# EAGLE design batt_test (EAGLE 9.5.2)
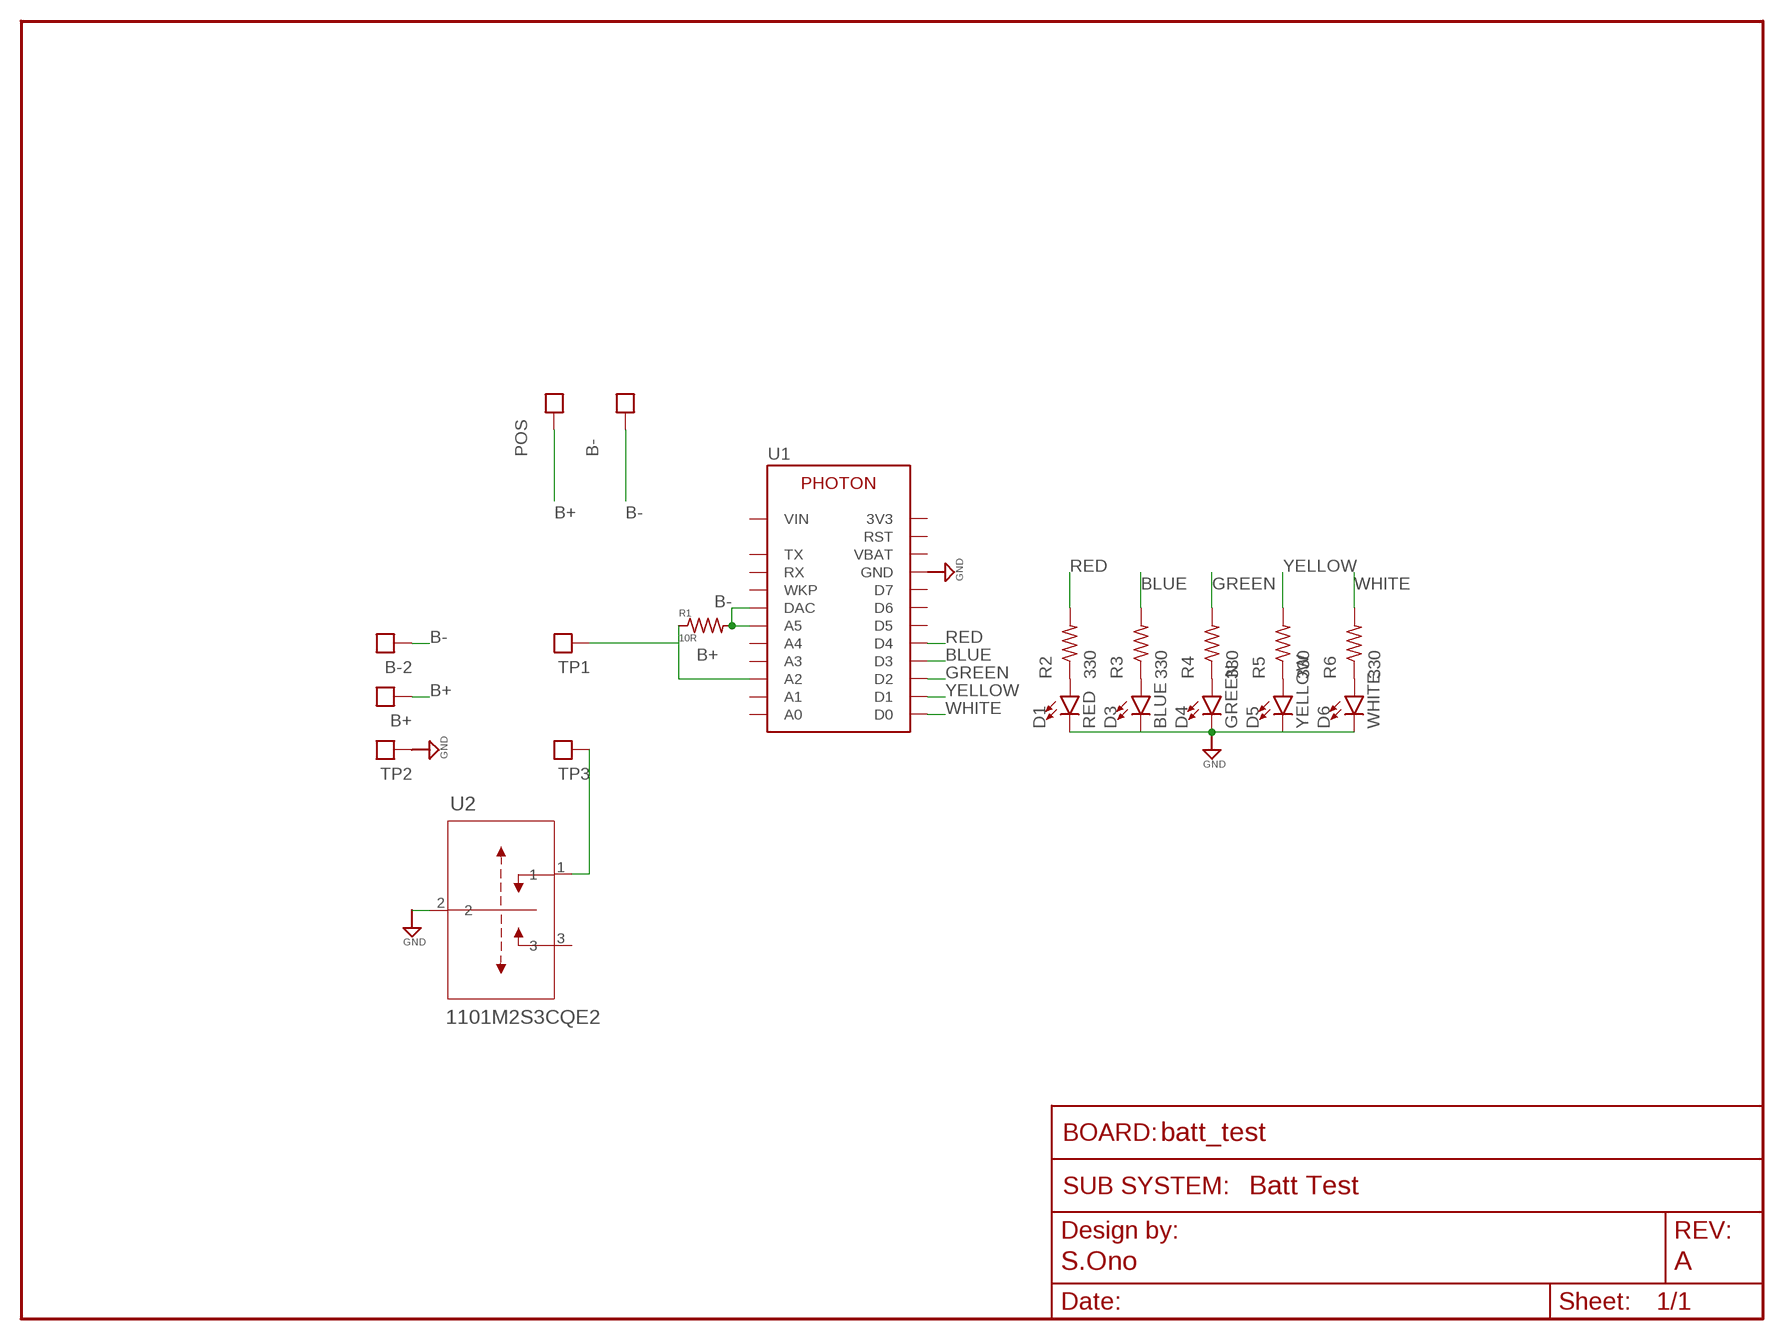
[diagram p0: schematic, sheet 1]
FRAME1 (FRAME_SCHEMATIC): AUTHOR: S.Ono; REV: A; SUBSYSTEM_NAME: Batt Test

## Parts
B+  TEST_POINTTHRU  [TEST_POINT]
B-  TEST_POINT  [TEST_POINT-1206]
B-2  TEST_POINTTHRU  [TEST_POINT]
D1  RED  LED0603  [LED-0603]
D3  BLUE  LED0603  [LED-0603]
D4  GREEN  LED0603  [LED-0603]
D5  YELLOW  LED0603  [LED-0603]
D6  WHITE  LED0603  [LED-0603]
POS  TEST_POINT  [TEST_POINT-1206]
R1  10R  R-US_R0805  [R0805]
R2  330  R-US_R0402  [R0402]
R3  330  R-US_R0402  [R0402]
R4  330  R-US_R0402  [R0402]
R5  330  R-US_R0402  [R0402]
R6  330  R-US_R0402  [R0402]
TP1  TEST_POINTTHRU  [TEST_POINT]
TP2  TEST_POINTTHRU  [TEST_POINT]
TP3  TEST_POINTTHRU  [TEST_POINT]
U1  PHOTON  [PHOTON]
U2  1101M2S3CQE2  [1101M2S3CQE2]

## Nets
B+: B+.1 POS.1 R1.1 TP1.1 U1.A2
B-: B-2.1 B-.1 R1.2 U1.A5 U1.DAC
BLUE: R3.2 U1.D3
GND: D1.C D3.C D4.C D5.C D6.C TP2.1 U1.GND U1.GND@1(GND) U2.2
GREEN: R4.2 U1.D2
N$1: TP3.1 U2.1
N$6: D1.A R2.1
N$8: D3.A R3.1
N$9: D4.A R4.1
N$11: D5.A R5.1
N$12: D6.A R6.1
RED: R2.2 U1.D4
WHITE: R6.2 U1.D0
YELLOW: R5.2 U1.D1
Unconnected: U1.3V3 U1.A0 U1.A1 U1.A3 U1.A4 U1.D5 U1.D6 U1.D7 U1.RST U1.RX U1.TX U1.VBAT U1.VIN U1.WKP U2.3

## Library data of the parts
B+ B- B-2 POS TP1-TP3 = scono:TEST_POINT: 1206 Test point for O-scope probes. For A106146CT-ND or similar
D1 D3-D6 = scono:LED: https://www.digikey.com/products/en/optoelectronics/led-indication-discrete/105?k=&pkeyword=&pv7=2&pv1989=0&pv16=5&FV=ffe00069&quantity=0&ColumnSort=0&page=1&pageSize=25
R1 = scono:R-US_: RESISTOR, American symbol; PIE-INT-REF-NUM: RESISTOR-GENERIC
R2-R6 = BEST_Custom:R-US_: RESISTOR, American symbol; PIE-INT-REF-NUM: RESISTOR-GENERIC
U1 = scono:PHOTON
U2 = scono:1101M2S3CQE2: https://www.digikey.com/product-detail/en/c-k/1101M2S3CQE2/CKN5001-ND/67042; MANUFACTURER_PART_NUMBER: 1101M2S3CQE2; VENDOR: C&K

## Board
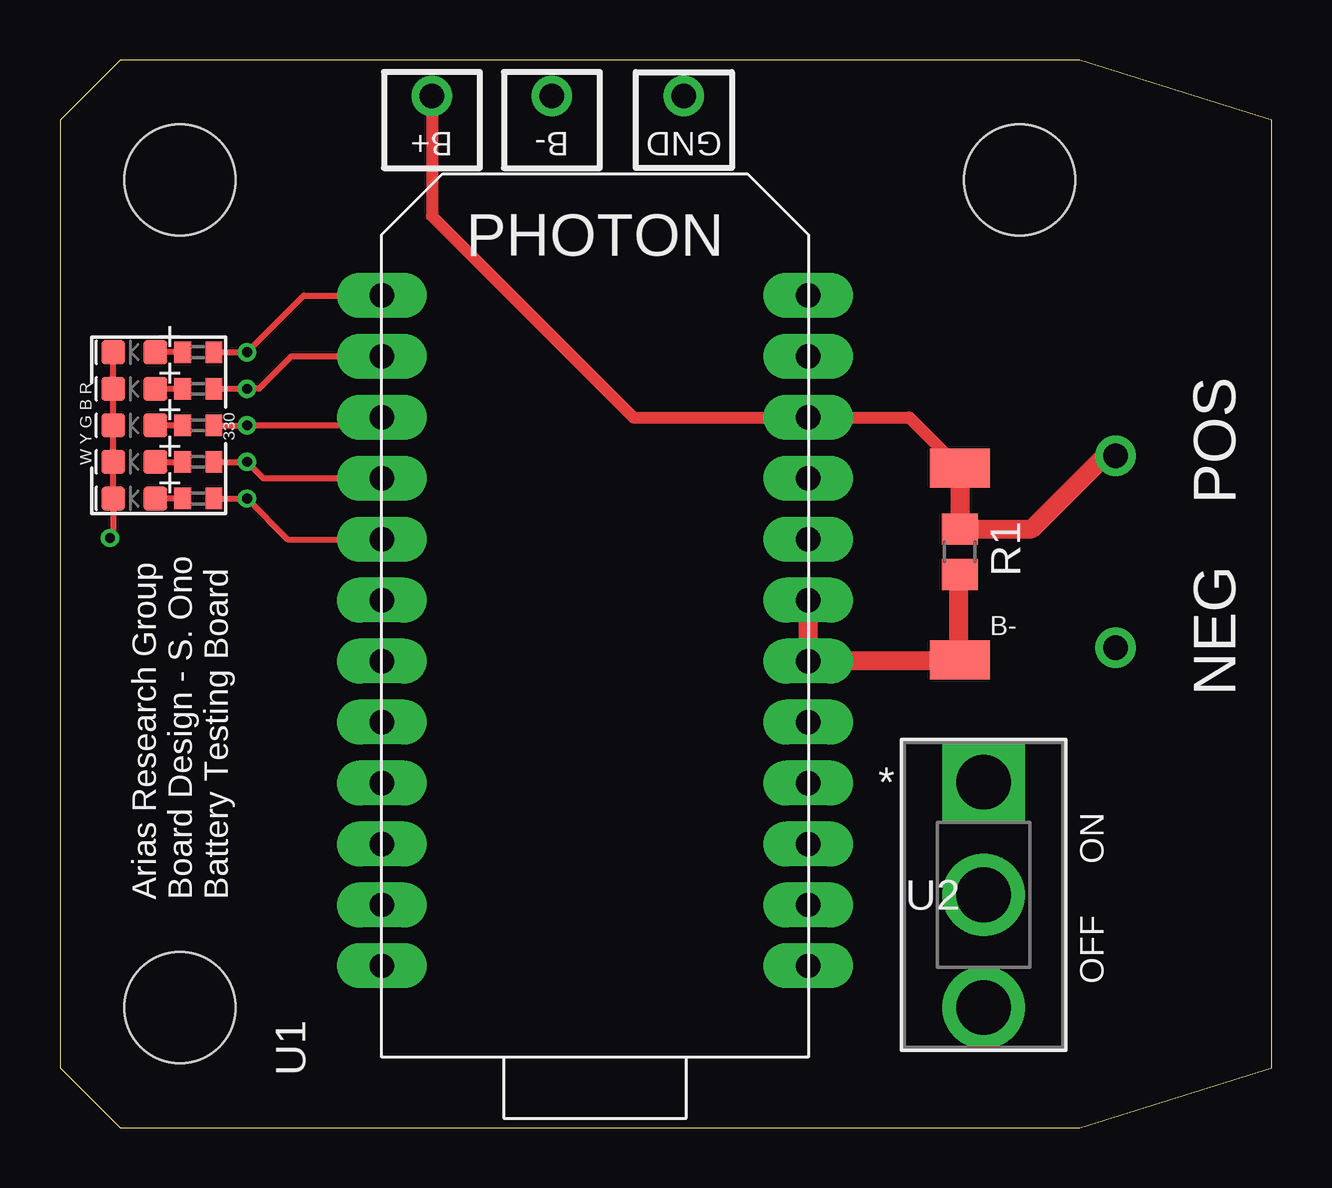
[diagram p1: board, top side]
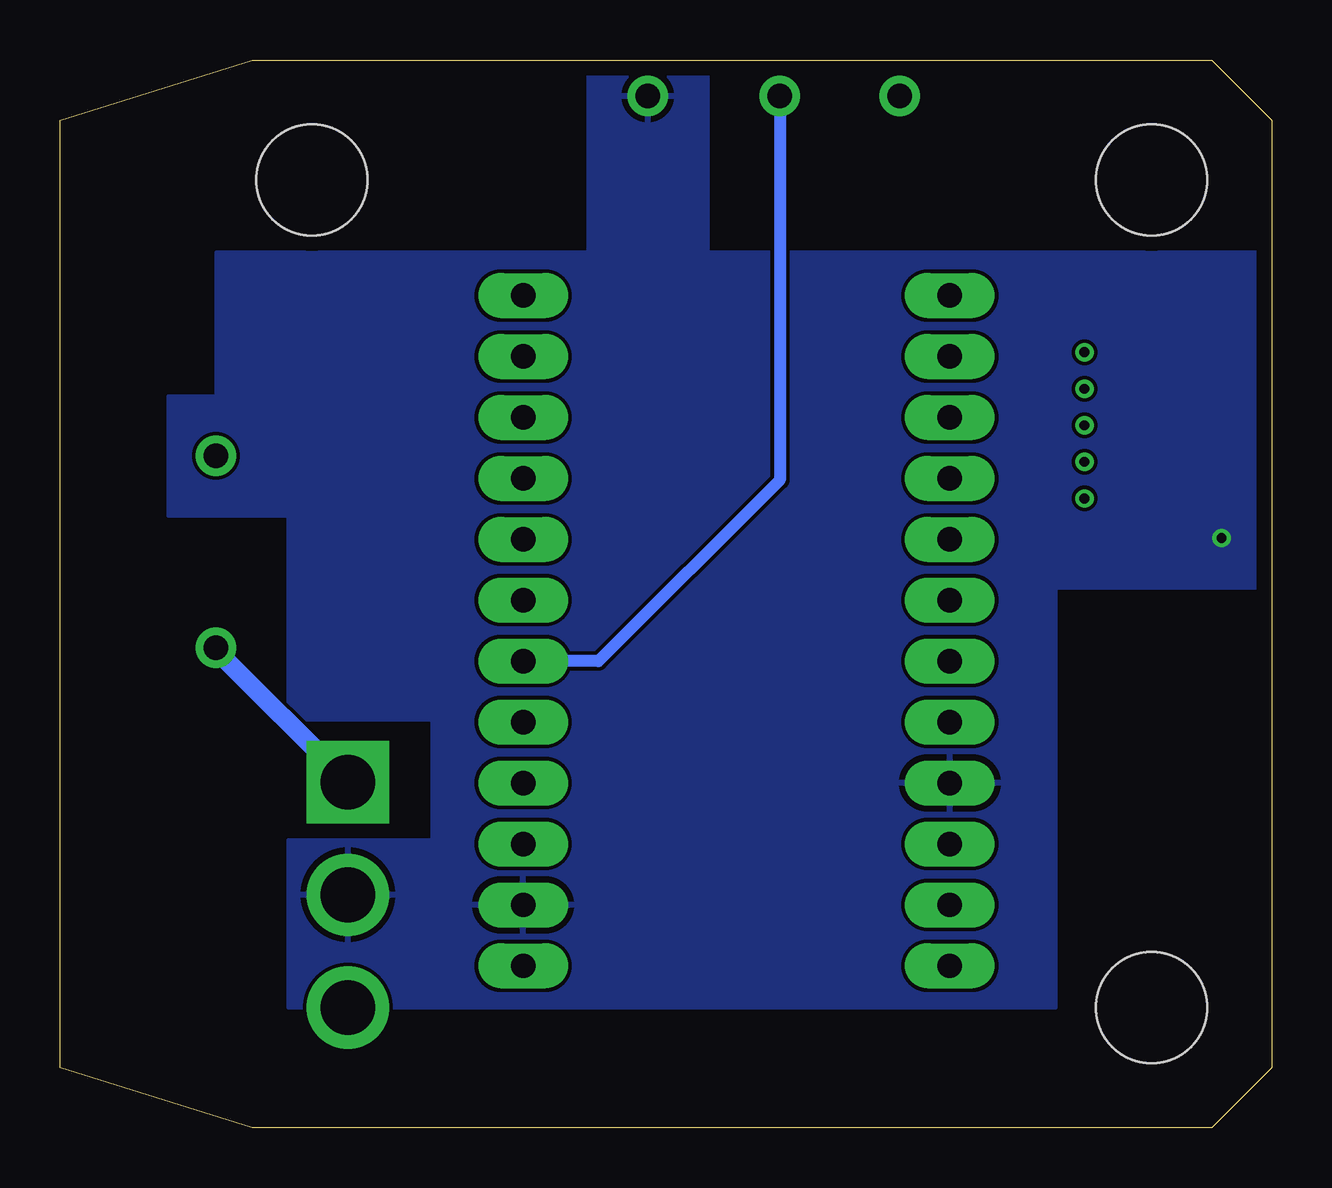
[diagram p2: board, bottom side, seen from below]

Size 50.5 x 44.5 mm. Coordinates in mm from the lower left corner, seen from the top.
Outline: 0,2.5 2.5,0 42.5,0 50.5,2.5 50.5,42 42.5,44.5 2.5,44.5 0,42 0,2.5
Copper layers (1*16): Top 2mil / dielectric 9mil / Bottom 2mil
Design rules "scono *": minimum track width 6mil, minimum drill 15mil, track to track 6mil, track to pad 6mil, pad to pad 6mil, via to via 6mil, smd to smd 6mil, copper to edge 25mil, drill to drill 7mil, minimum pad ring 7mil, minimum via ring 7mil, stop-mask expansion 3mil, vias tented up to drill 0mil, thermal gap 10mil

### Footprints (pad centres in the part's own frame; a part is rotated, then mirrored left to right if it is on the bottom)
TEST_POINT = drill 1.016 pad 1.676: 1 0,0
TEST_POINT-1206 = smd 2.5 x 1.625: 1 0,0
LED-0603 = smd 1 x 1: A -0.877,0; C 0.877,0
R0805 = smd 1.3 x 1.5: 1 -0.95,0; 2 0.95,0
R0402 = smd 0.7 x 0.9: 1 -0.65,0; 2 0.65,0
PHOTON = drill 1.016 pad 1.88 long: 3V3 -15.24,8.89; A0 12.7,-8.89; A1 10.16,-8.89; A2 7.62,-8.89; A3 5.08,-8.89; A4 2.54,-8.89; A5 0,-8.89; D0 12.7,8.89; D1 10.16,8.89; D2 7.62,8.89; D3 5.08,8.89; D4 2.54,8.89; D5 0,8.89; D6 -2.54,8.89; D7 -5.08,8.89; DAC -2.54,-8.89; GND -7.62,8.89; GND@1 -12.7,-8.89; RST -12.7,8.89; RX -7.62,-8.89; TX -10.16,-8.89; VBAT -10.16,8.89; VIN -15.24,-8.89; WKP -5.08,-8.89
1101M2S3CQE2 = drill 2.286 pad 2.794 square: 1 0,9.398 | drill 2.286 pad 2.794: 2 0,4.699; 3 0,0
4-40-HOLE = hole 4.636: 0,0

### Placement (x,y rotation side)
B+  15.5,43 0 top
B-  37.5,19.5 0 top
B-2  20.5,43 0 top
D1  3.1,26.22 180 top
D3  3.1,27.75 180 top
D4  3.1,29.27 180 top
D5  3.1,30.79 180 top
D6  3.1,32.32 180 top
POS  37.5,27.5 0 top
R1  37.5,24 270 top
R2  5.76,26.22 0 top
R3  5.76,27.75 0 top
R4  5.76,29.27 0 top
R5  5.76,30.79 0 top
R6  5.76,32.32 0 top
TP1  44,28 0 top
TP2  26,43 0 top
TP3  44,20 0 top
U1  22.3,21.98 90 top
U2  38.5,5 0 top
U$1  [4-40-HOLE]  5,5 0 top
U$3  [4-40-HOLE]  5,39.5 0 top
U$4  [4-40-HOLE]  40,39.5 0 top

### Tracks (layer width: path | path; a pad name or v marks a point on that pad's centre or on a via)
B+
  Top 0.5: B+.1 15.5,38 23.9,29.6 U1.A2 35.4,29.6 POS.1
  Top 0.8: TP1.1 43.55,28 40.5,24.95 37.55,24.95 | POS.1 37.5,25 | 37.5,25 R1.1 37.55,24.95 | 37.55,24.95 37.5,25
B-
  Top 0.254: B-.1 37.44,19.44
  Top 0.8: U1.A5 U1.DAC 37.44,19.44 37.44,22.99 R1.2
  Bottom 0.5: B-2.1 20.5,27 28.06,19.44 U1.DAC
BLUE  (via drill 0.41)
  Top 0.254: R3.2 v7.8,27.75 8.48,27.06 U1.D3
GND  (via drill 0.41)
  Top 0.254: D6.C D5.C D4.C D3.C D1.C 2.22,24.71 v2.08,24.57
  pour Bottom: 0.5,36.5 23.5,36.5 23.5,44.5 28.5,44.5 28.5,36.5 44,36.5 44,30.5 46,30.5 46,25.5 41,25.5 41,17 35,17 35,12 41,12 41,5 9,5 9,22.5 0.5,22.5
GREEN  (via drill 0.41)
  Top 0.254: R4.2 v7.8,29.27 11.81,29.27 12.14,29.6 U1.D2
N$1
  Bottom 0.8: U2.1 44,19.9 TP3.1
N$6
  Top 0.254: R2.1 D1.A
N$8
  Top 0.254: D3.A R3.1
N$9
  Top 0.254: R4.1 D4.A
N$11
  Top 0.254: D5.A R5.1
N$12
  Top 0.254: R6.1 D6.A
RED  (via drill 0.41)
  Top 0.254: R2.2 v7.8,26.22 9.5,24.52 U1.D4
WHITE  (via drill 0.41)
  Top 0.254: R6.2 v7.8,32.32 10.16,34.68 U1.D0
YELLOW  (via drill 0.41)
  Top 0.254: R5.2 v7.8,30.79 8.29,30.79 9.64,32.14 U1.D1

### Text on the board
tPlace: B+ | B- | GND | 330 | W Y G B R | POS | NEG | ON | Arias Research Group / Board Design - S. Ono / Battery Testing Board | OFF